# Altium schematic sheet NRF Module.SchDoc: Title
size A4; Date: *******; ApprovedBy: *******; CheckedBy: None; Author: *******; CompanyName: *******; DrawnBy: Name; Engineer: *******; Organization: *******; Address1: *******; Address2: *******; Address3: *******; Address4: *******; DocumentNumber: Doc Num; Revision: *******; SheetNumber: 7; SheetTotal: 9; Subtitle: Subtitle; Project: Project; VersionRevision: VersionRevision; TotalSheet: TotalSheet; CurrentTime: *******; CurrentDate: *******; Time: *******; DocumentFullPathAndName: *******; DocumentName: *******; ModifiedDate: *******; ImagePath: *******; ProjectName: *******; Application_BuildNumber: *******
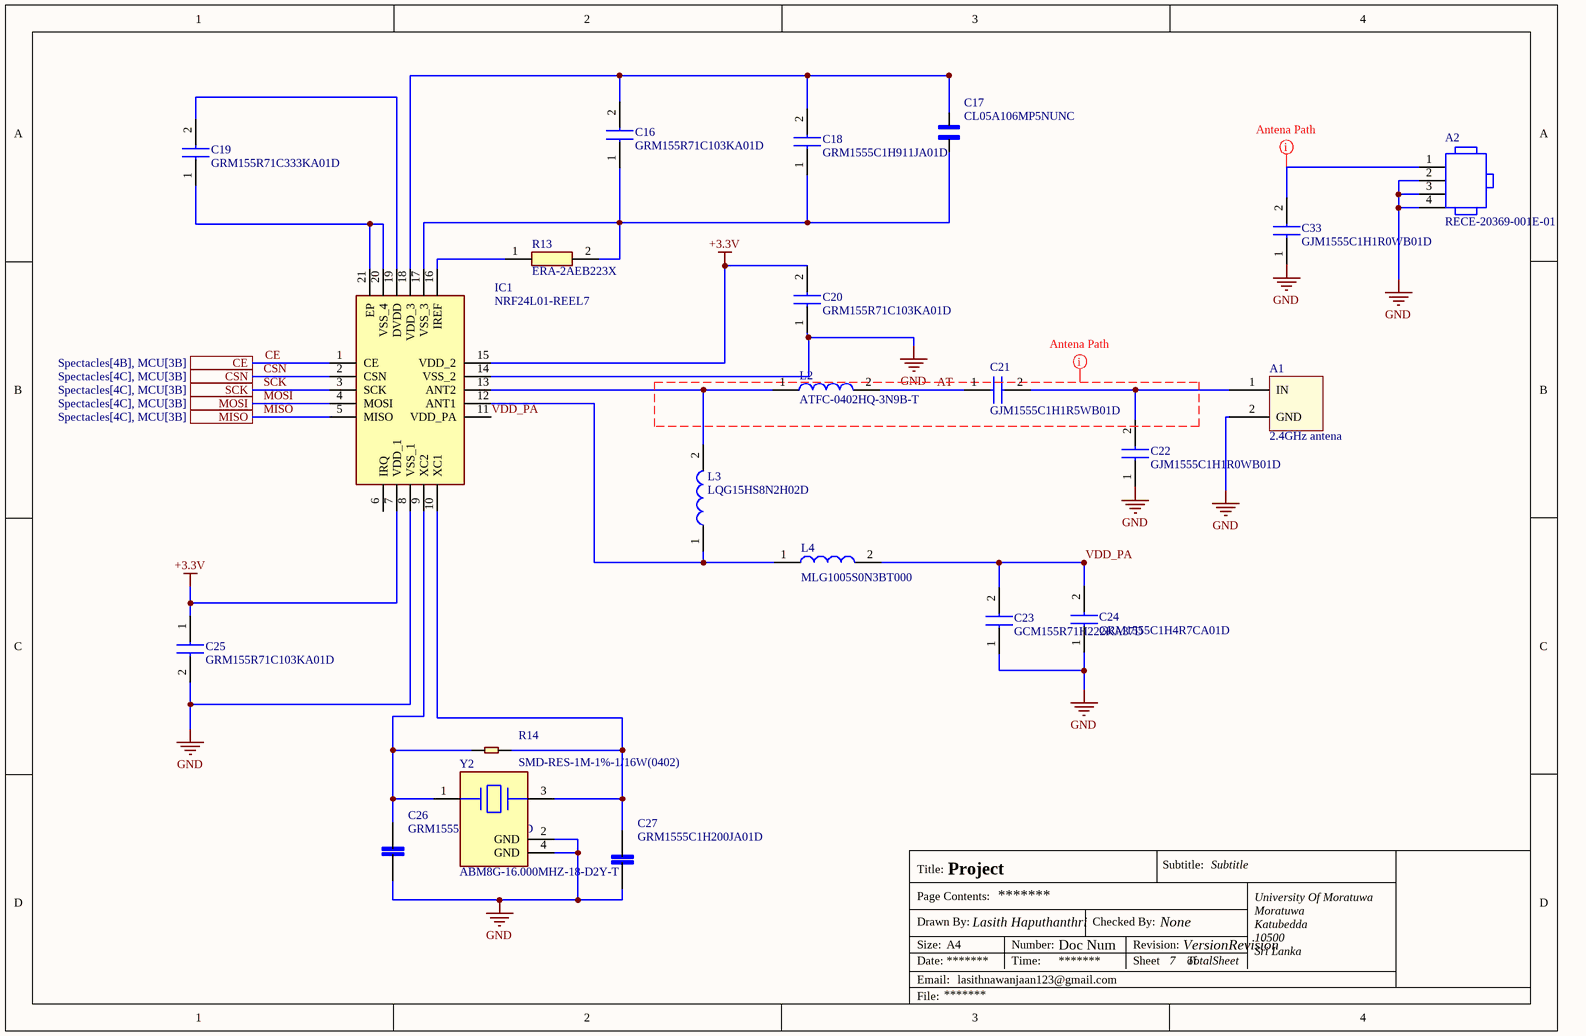
[diagram p0: NRF Module.SchDoc]

## Parts
A1  2.4GHz antena  [Antena]  (net tie, no BOM)
A2  RECE-20369-001E-01  [TG-RECE-20369-001E-4_V]
C16  GRM155R71C103KA01D  [CAPC1005X55N]
C17  CL05A106MP5NUNC  [CAPC1005X55N]
C18  GRM1555C1H911JA01D  [CAPC1005X55N]
C19  GRM155R71C333KA01D  [CAPC1005X55N]
C20  GRM155R71C103KA01D  [CAPC1005X55N]
C21  GJM1555C1H1R5WB01D  [CAPC1005X55N]
C22  GJM1555C1H1R0WB01D  [CAPC1005X55N]
C23  GCM155R71H222KA37D  [CAPC1005X55N]
C24  GRM1555C1H4R7CA01D  [CAPC1005X55N]
C25  GRM155R71C103KA01D  [CAPC1005X55N]
C26  GRM1555C1H200JA01D  [CAPC1005X55N]
C27  GRM1555C1H200JA01D  [CAPC1005X55N]
C33  GJM1555C1H1R0WB01D  [CAPC1005X55N]
IC1  NRF24L01-REEL7  [QFN50P400X400X80-21N-D]
L2  ATFC-0402HQ-3N9B-T  [INDC1005X37N]
L3  LQG15HS8N2H02D  [LQG15WH0N7B02D]
L4  MLG1005S0N3BT000  [MLG1005]
R13  ERA-2AEB223X  [ERA2AED122X]
R14  SMD-RES-1M-1%-1/16W(0402)  [R0402]
Y2  ABM8G-16.000MHZ-18-D2Y-T  [FP-ABM8G-MFG]

## Ports
CE (see Spectacles[4B], MCU[3B]), CSN (see Spectacles[4C], MCU[3B]), MISO (see Spectacles[4C], MCU[3B]), MOSI (see Spectacles[4C], MCU[3B]), SCK (see Spectacles[4C], MCU[3B])

## Nets
+3.3V: C20.2 C25.1 IC1.7(VDD_1) IC1.15(VDD_2)
GND: A1.2(GND) A2.2 A2.3 A2.4 C20.1 C22.1 C23.1 C24.1 C25.2 C26.1 C27.1 C33.1 IC1.8(VSS_1) IC1.14(VSS_2) Y2.2(GND) Y2.4(GND)
AT: C21.1 L2.2
CE: IC1.1(CE) ; port CE
CSN: IC1.2(CSN) ; port CSN
MISO: IC1.5(MISO) ; port MISO
MOSI: IC1.4(MOSI) ; port MOSI
SCK: IC1.3(SCK) ; port SCK
VDD_PA: C23.2 C24.2 IC1.11(VDD_PA) L4.2
NetA1_1: A1.1(IN) C21.2 C22.2
NetA2_1: A2.1 C33.2
NetC16_1: C16.1 C17.1 C18.1 IC1.17(VSS_3) R13.2
NetC16_2: C16.2 C17.2 C18.2 IC1.18(VDD_3)
NetC19_1: C19.1 IC1.20(VSS_4) IC1.21(EP)
NetC19_2: C19.2 IC1.19(DVDD)
NetC26_2: C26.2 IC1.9(XC2) R14.1 Y2.1
NetC27_2: C27.2 IC1.10(XC1) R14.2 Y2.3
NetIC1_12: IC1.12(ANT1) L3.1 L4.1
NetIC1_13: IC1.13(ANT2) L2.1 L3.2
NetIC1_16: IC1.16(IREF) R13.1

Not connected (* = marked no-connect by the designer): IC1 6(IRQ)

## Layout directives
net class Antena: AT, NetA2_1

## Notes on the sheet
- Title:
- Drawn By:
- Page Contents:
- Checked By:
- Subtitle:
- University Of Moratuwa
- Moratuwa
- Size:
- Date:
- File:
- Email:
- A4
- lasithnawanjaan123@gmail.com
- Lasith Haputhanthri
- Number:
- Time:
- Revision:
- Sheet
- of
- Katubedda
- 10500
- Sri Lanka

## Library data of the parts
A2 = CMP-0275-00001-2: RF Connector, Onboard Receptacle, IPEX MHFIII; Manufacturer: Taoglas; Packing: Tape and Reel; Mounting Technology: Surface Mount; PackageReference: RECE-20369-001E-01-4; ComponentLink1URL: http://www.taoglas.com/; Housing Color: Gold; DatasheetVersion: Rev. C; ComponentLink2URL: http://www.taoglas.com/images/product_images/original_images/RECE.20369.001E.01.pdf; ComponentLink3Description: Package Specification; PackageVersion: Rev. C; ComponentLink1Description: Manufacturer URL; ComponentLink2Description: Datasheet; PackageDescription: 4-Pin, Hand Drawn, Body 1.7x1.7mm; ComponentLink3URL: http://www.taoglas.com/images/product_images/original_images/RECE.20369.001E.01.pdf; PartNumber: RECE-20369-001E-01
C16 C20 C25 = GRM155R71C103KA01D: Capacitor; Manufacturer_Name: Murata Electronics; Datasheet Link: http://www.murata.com/~/media/webrenewal/support/library/catalog/products/capacitor/mlcc/c02e.pdf; Height: 0.55mm; Manufacturer_Part_Number: GRM155R71C103KA01D; Mouser Part Number: 81-GRM36X103K16; Mouser Price/Stock: https://www.mouser.co.uk/ProductDetail/Murata-Electronics/GRM155R71C103KA01D?qs=8YPuuxuUzMI%252B9QLnzeLwhQ%3D%3D; Arrow Part Number: GRM155R71C103KA01D; Arrow Price/Stock: https://www.arrow.com/en/products/grm155r71c103ka01d/murata-manufacturing?region=europe
C17 = CL05A106MP5NUNC: 10 ÂµF Â±20% 10V Ceramic Capacitor X5R 0402 (1005 Metric); MF: Samsung Electro-Mechanics; Check_prices: https://www.snapeda.com/parts/CL05A106MP5NUNC/Samsung+Electro-Mechanics/view-part/?ref=eda; MP: CL05A106MP5NUNC; Package: 0402 Samsung; SnapEDA_Link: https://www.snapeda.com/parts/CL05A106MP5NUNC/Samsung+Electro-Mechanics/view-part/?ref=snap; Value: *
C18 = GRM1555C1H911JA01D: Capacitor; Manufacturer_Name: Murata Electronics; Datasheet Link: http://www.murata.com/~/media/webrenewal/support/library/catalog/products/capacitor/mlcc/c02e.pdf; Height: 0.55mm; Manufacturer_Part_Number: GRM1555C1H911JA01D; Mouser Part Number: 81-GRM1555C1H911JA1D; Mouser Price/Stock: https://www.mouser.co.uk/ProductDetail/Murata-Electronics/GRM1555C1H911JA01D?qs=p6VZ%252BklCkRTpKNdGAzqH7g%3D%3D
C19 = GRM155R71C333KA01D: Capacitor; Manufacturer_Name: Murata Electronics; Datasheet Link: http://www.murata.com/~/media/webrenewal/support/library/catalog/products/capacitor/mlcc/c02e.pdf; Height: 0.55mm; Manufacturer_Part_Number: GRM155R71C333KA01D; Arrow Part Number: GRM155R71C333KA01D; Arrow Price/Stock: https://www.arrow.com/en/products/grm155r71c333ka01d/murata-manufacturing
C21 = GJM1555C1H1R5WB01D: Capacitor; Manufacturer_Name: Murata Electronics; Datasheet Link: https://psearch.en.murata.com/capacitor/product/GJM1555C1H1R5WB01%23.html; Height: 0.55mm; Manufacturer_Part_Number: GJM1555C1H1R5WB01D; Mouser Part Number: 81-GJM1555C1H1R5WB1D; Mouser Price/Stock: https://www.mouser.co.uk/ProductDetail/Murata-Electronics/GJM1555C1H1R5WB01D?qs=YLLXL5qGyDucsRPozQcunA%3D%3D; Arrow Part Number: GJM1555C1H1R5WB01D; Arrow Price/Stock: https://www.arrow.com/en/products/gjm1555c1h1r5wb01d/murata-manufacturing?region=nac
C22 C33 = GJM1555C1H1R0WB01D: Capacitor; Manufacturer_Name: Murata Electronics; Datasheet Link: https://psearch.en.murata.com/capacitor/product/GJM1555C1H1R0WB01%23.html; Height: 0.55mm; Manufacturer_Part_Number: GJM1555C1H1R0WB01D; Mouser Part Number: 81-GJM1555C1H1R0WB1D; Mouser Price/Stock: https://www.mouser.co.uk/ProductDetail/Murata-Electronics/GJM1555C1H1R0WB01D?qs=YLLXL5qGyDtaruZHJwTPNg%3D%3D; Arrow Part Number: GJM1555C1H1R0WB01D; Arrow Price/Stock: https://www.arrow.com/en/products/gjm1555c1h1r0wb01d/murata-manufacturing?region=nac
C23 = GCM155R71H222KA37D: Capacitor; Manufacturer_Name: Murata Electronics; Datasheet Link: https://psearch.en.murata.com/capacitor/product/GCM155R71H222KA37%23.html; Height: 0.55mm; Manufacturer_Part_Number: GCM155R71H222KA37D; Mouser Part Number: 81-GCM155R71H222K37D; Mouser Price/Stock: https://www.mouser.co.uk/ProductDetail/Murata-Electronics/GCM155R71H222KA37D?qs=QDXoN8f0aYKEsLYYwicpIw%3D%3D; Arrow Part Number: GCM155R71H222KA37D; Arrow Price/Stock: https://www.arrow.com/en/products/gcm155r71h222ka37d/murata-manufacturing?region=nac
C24 = GRM1555C1H4R7CA01D: Capacitor; Manufacturer_Name: Murata Electronics; Datasheet Link: http://www.murata.com/~/media/webrenewal/support/library/catalog/products/capacitor/mlcc/c02e.pdf; Height: 0.55mm; Manufacturer_Part_Number: GRM1555C1H4R7CA01D; Mouser Part Number: 81-GRM1555C1H4R7CA1D; Mouser Price/Stock: https://www.mouser.co.uk/ProductDetail/Murata-Electronics/GRM1555C1H4R7CA01D?qs=4k9rjS6ZRl7tSQRzstyMVg%3D%3D; Arrow Part Number: GRM1555C1H4R7CA01D; Arrow Price/Stock: https://www.arrow.com/en/products/grm1555c1h4r7ca01d/murata-manufacturing
C26 C27 = GRM1555C1H200JA01D: SMD Capacitor C0G(EIA) with Capacitance: 20pF Tol. 5%. Rated Voltage: 50Vdc; MF: Murata; Check_prices: https://www.snapeda.com/parts/GRM1555C1H200JA01D/Murata+Electronics+North+America/view-part/?ref=eda; MP: GRM1555C1H200JA01D; Package: 1005 Taiyo Yuden; SnapEDA_Link: https://www.snapeda.com/parts/GRM1555C1H200JA01D/Murata+Electronics+North+America/view-part/?ref=snap; Value: *
IC1 = NRF24L01-REEL7: Integrated Circuit; Manufacturer_Name: Nordic Semiconductor; Datasheet Link: https://4donline.ihs.com/images/VipMasterIC/IC/NRSA/NRSAS00020/NRSAS00020-1.pdf?hkey=EF798316E3902B6ED9A73243A3159BB0; Height: 0.8mm; Manufacturer_Part_Number: NRF24L01-REEL7; Mouser Part Number: 949-NRF24L01-REEL7; Mouser Price/Stock: https://www.mouser.co.uk/ProductDetail/Nordic-Semiconductor/nRF24L01-REEL7?qs=yd0qOhnSiDfNM3Q865kckA%3D%3D; Arrow Part Number: NRF24L01-REEL7; Arrow Price/Stock: null?region=nac
L2 = ATFC-0402HQ-3N9B-T: Inductor; Manufacturer_Name: ABRACON; Datasheet Link: https://abracon.com/Magnetics/inductors/ATFC-0402HQ.pdf; Height: 0.37mm; Manufacturer_Part_Number: ATFC-0402HQ-3N9B-T
L3 = LQG15HS8N2H02D: Inductor; Manufacturer_Name: Murata Electronics; Datasheet Link: https://psearch.en.murata.com/inductor/product/LQG15HS8N2H02%23.html; Height: 0.55mm; Manufacturer_Part_Number: LQG15HS8N2H02D; Mouser Part Number: 81-LQG15HS8N2H02D; Mouser Price/Stock: https://www.mouser.co.uk/ProductDetail/Murata-Electronics/LQG15HS8N2H02D?qs=60uY6ySkanTiptaknJqb2Q%3D%3D; Arrow Part Number: LQG15HS8N2H02D; Arrow Price/Stock: https://www.arrow.com/en/products/lqg15hs8n2h02d/murata-manufacturing
L4 = MLG1005S0N3BT000: Inductor; Manufacturer_Name: TDK; Datasheet Link: https://product.tdk.com/system/files/dam/doc/product/inductor/inductor/smd/catalog/inductor_commercial_high-frequency_mlg1005s_en.pdf; Manufacturer_Part_Number: MLG1005S0N3BT000; Mouser Part Number: 810-MLG1005S0N3BT000; Mouser Price/Stock: https://www.mouser.co.uk/ProductDetail/TDK/MLG1005S0N3BT000?qs=u4%252BEJ9urDASg1T%252BCePJhFw%3D%3D; Arrow Part Number: MLG1005S0N3BT000; Arrow Price/Stock: https://www.arrow.com/en/products/mlg1005s0n3bt000/tdk
R13 = ERA-2AEB223X: Resistor; Manufacturer_Name: Panasonic; Datasheet Link: http://industrial.panasonic.com/cdbs/www-data/pdf/RDM0000/AOA0000C307.pdf; Height: 0.4mm; Manufacturer_Part_Number: ERA-2AEB223X; Mouser Part Number: 667-ERA-2AEB223X; Mouser Price/Stock: https://www.mouser.co.uk/ProductDetail/Panasonic/ERA-2AEB223X?qs=YFwoyZoVY0gOqA4AmOyJ2g%3D%3D; Arrow Part Number: ERA-2AEB223X; Arrow Price/Stock: https://www.arrow.com/en/products/era2aeb223x/panasonic?region=europe
R14 = SMD-RES-1M-1%-1/16W(0402): 1 MOhms Â±1% 0.063W, 1/16W Chip Resistor 0402 (1005 Metric) Moisture Resistant Thick Film; MF: Yageo; MP: RC0402FR-071ML; Availability: In Stock; Check_prices: https://www.snapeda.com/parts/RC0402FR-071ML/Yageo/view-part/?ref=eda; Package: 0402 Yageo; Price: None; Purchase-URL: https://pricing.snapeda.com/search/part/RC0402FR-071ML/?ref=eda; SnapEDA_Link: https://www.snapeda.com/parts/RC0402FR-071ML/Yageo/view-part/?ref=snap; Value: *
Y2 = CMP-2000-05039-3: Crystal 12MHz ±20ppm (Tol) ±30ppm (Stability) 18pF FUND 120Ω 4-Pin SMD T/R; Series Resistance: 120R; Max Operating Temperature: 85°C; Mount: Surface Mount; Width: 2.5mm; Series: ABM8G; Termination: SMD/SMT; Frequency Tolerance: 20ppm; Tolerance: 20ppm; Min Operating Temperature: -40°C; Operating Frequency: 12 MHz; Depth: 2.5mm; Load Capacitance: 18pF; Number of Pins: 4; Length: 3.2mm; Radiation Hardening: No; Frequency Stability: 30ppm; Height: 1mm; Packaging: Tape and Reel; Package Quantity: 1000; ESR (Equivalent Series Resistance): 120R; Lead Free: Lead Free; Frequency: 12MHz; Case/Package: CSMD